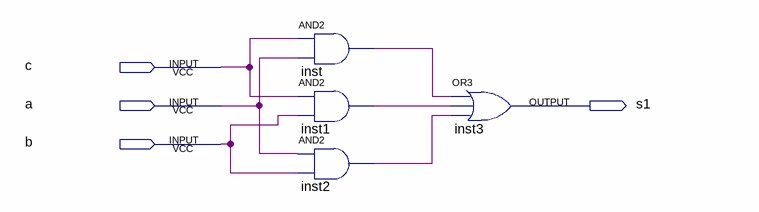
[diagram p0: schematic sheet]
// Quartus schematic Lab02.bdf as structural Verilog: 4 symbols, 4 pins
module Lab02 (
  input  c,
  input  a,
  input  b,
  output s1
);

  wire inst1_out, inst2_out, inst_out;

  and inst (inst_out, c, a);
  and inst1 (inst1_out, c, b);
  and inst2 (inst2_out, a, b);
  or inst3 (s1, inst_out, inst1_out, inst2_out);
endmodule
